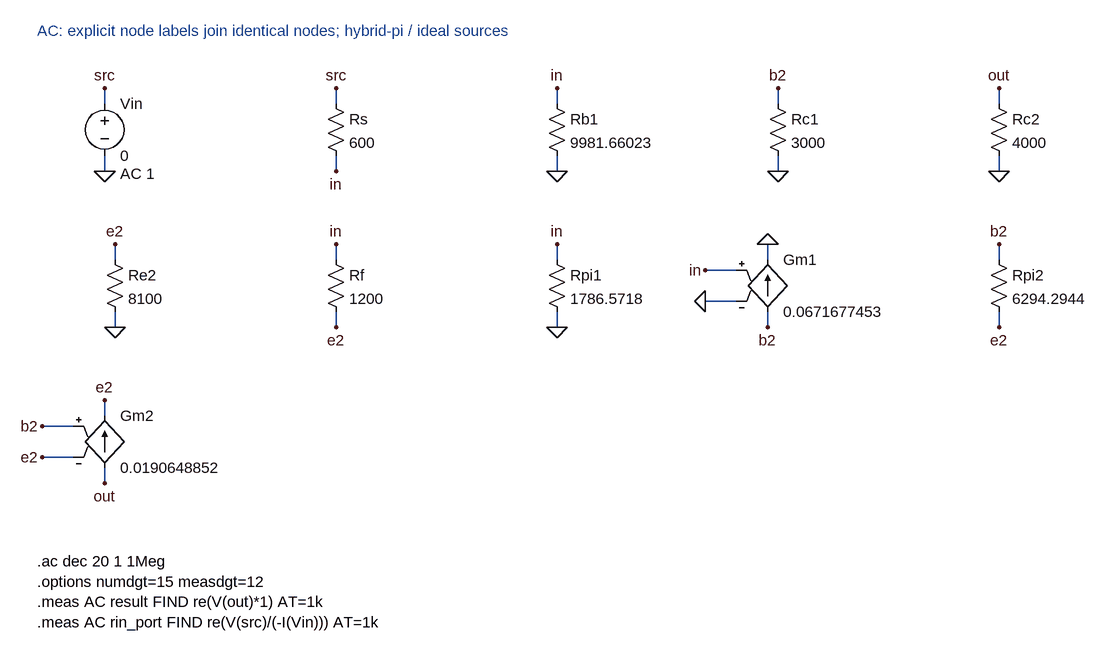
[diagram p0: schematic AC.asc]
AC.asc, the LTspice schematic file:
Version 4
SHEET 1 1800 1500
TEXT 16 -48 Left 2 ;AC: explicit node labels join identical nodes; hybrid-pi / ideal sources
WIRE 120 64 120 40
FLAG 120 40 src
WIRE 120 144 120 168
FLAG 120 168 0
SYMBOL voltage 120 48 R0
SYMATTR InstName Vin
WINDOW 123 24 124 Left 2
SYMATTR Value 0
SYMATTR Value2 AC 1
WIRE 476 64 476 40
FLAG 476 40 src
WIRE 476 144 476 168
FLAG 476 168 in
SYMBOL res 460 48 R0
SYMATTR InstName Rs
SYMATTR Value 600
WIRE 816 64 816 40
FLAG 816 40 in
WIRE 816 144 816 168
FLAG 816 168 0
SYMBOL res 800 48 R0
SYMATTR InstName Rb1
SYMATTR Value 9981.66023
WIRE 1156 64 1156 40
FLAG 1156 40 b2
WIRE 1156 144 1156 168
FLAG 1156 168 0
SYMBOL res 1140 48 R0
SYMATTR InstName Rc1
SYMATTR Value 3000
WIRE 1496 64 1496 40
FLAG 1496 40 out
WIRE 1496 144 1496 168
FLAG 1496 168 0
SYMBOL res 1480 48 R0
SYMATTR InstName Rc2
SYMATTR Value 4000
WIRE 136 304 136 280
FLAG 136 280 e2
WIRE 136 384 136 408
FLAG 136 408 0
SYMBOL res 120 288 R0
SYMATTR InstName Re2
SYMATTR Value 8100
WIRE 476 304 476 280
FLAG 476 280 in
WIRE 476 384 476 408
FLAG 476 408 e2
SYMBOL res 460 288 R0
SYMATTR InstName Rf
SYMATTR Value 1200
WIRE 816 304 816 280
FLAG 816 280 in
WIRE 816 384 816 408
FLAG 816 408 0
SYMBOL res 800 288 R0
SYMATTR InstName Rpi1
SYMATTR Value 1786.5718
WIRE 1140 384 1140 408
FLAG 1140 408 b2
WIRE 1140 304 1140 280
FLAG 1140 280 0
WIRE 1092 320 1044 320
FLAG 1044 320 in
WIRE 1092 368 1044 368
FLAG 1044 368 0
SYMBOL g 1140 288 R0
SYMATTR InstName Gm1
SYMATTR Value 0.0671677453
WIRE 1496 304 1496 280
FLAG 1496 280 b2
WIRE 1496 384 1496 408
FLAG 1496 408 e2
SYMBOL res 1480 288 R0
SYMATTR InstName Rpi2
SYMATTR Value 6294.2944
WIRE 120 624 120 648
FLAG 120 648 out
WIRE 120 544 120 520
FLAG 120 520 e2
WIRE 72 560 24 560
FLAG 24 560 b2
WIRE 72 608 24 608
FLAG 24 608 e2
SYMBOL g 120 528 R0
SYMATTR InstName Gm2
SYMATTR Value 0.0190648852
TEXT 16 768 Left 2 !.ac dec 20 1 1Meg\n.options numdgt=15 measdgt=12\n.meas AC result FIND re(V(out)*1) AT=1k\n.meas AC rin_port FIND re(V(src)/(-I(Vin))) AT=1k

The netlist it stands for:
* AC.asc
Vin src 0 0 AC 1
Rs src in 600
Rb1 in 0 9981.66023
Rc1 b2 0 3000
Rc2 out 0 4000
Re2 e2 0 8100
Rf in e2 1200
Rpi1 in 0 1786.5718
Gm1 b2 0 in 0 0.0671677453
Rpi2 b2 e2 6294.2944
Gm2 out e2 b2 e2 0.0190648852
* AC: explicit node labels join identical nodes; hybrid-pi / ideal sources
.ac dec 20 1 1Meg
.options numdgt=15 measdgt=12
.meas AC result FIND re(V(out)*1) AT=1k
.meas AC rin_port FIND re(V(src)/(-I(Vin))) AT=1k
.backanno
.end

* Results of the author's LTspice run, read from the files saved beside the schematic
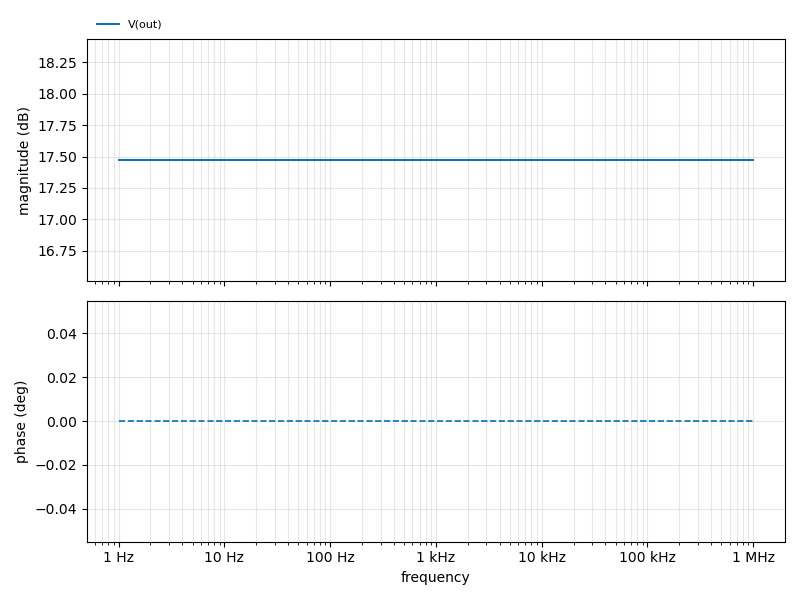
[diagram p1: AC Analysis of AC.asc, plotted from the saved traces]
* AC Analysis, 1 run:
*   V(out): 17.47 dB at 1 Hz, 17.47 dB at 1 MHz, peak 17.47 dB at 1 Hz
* From the log:
*   result: re(V(out)*1)=(17.4725031396dB,0°) at 1000
*   rin_port: re(V(src)/(-I(Vin)))=(55.6542449093dB,0°) at 1000